# EAGLE design V8502_v1 (EAGLE 7.7.0)
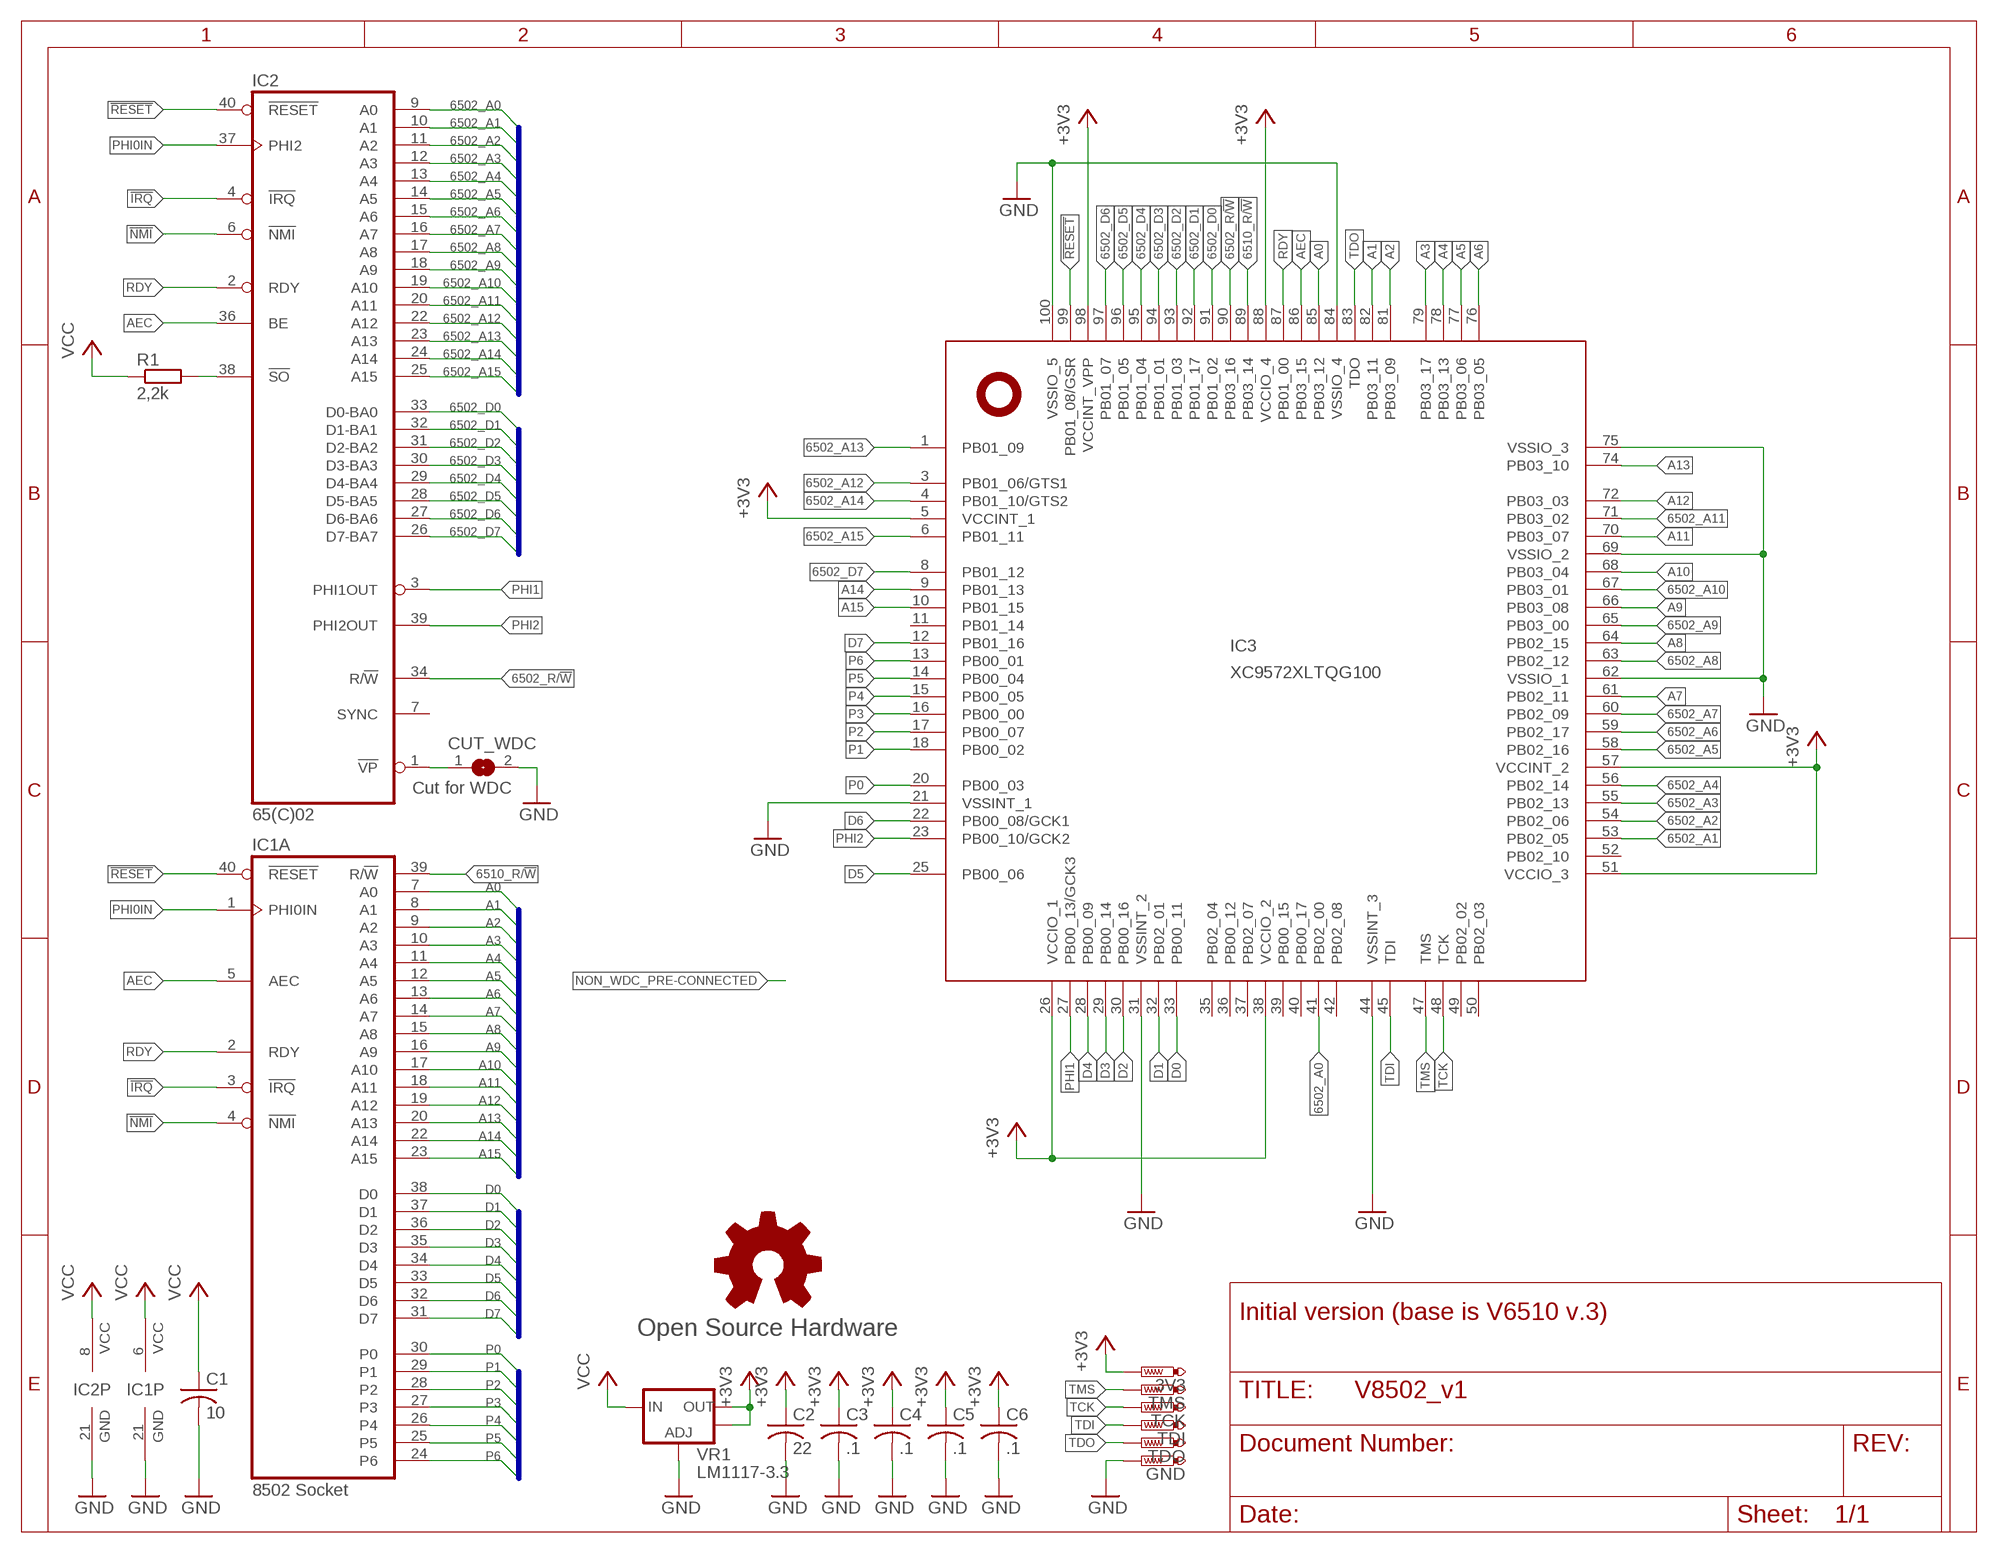
[diagram p0: schematic, sheet 1]

## Parts
3V3  PTR1TP08R  [TP08R]
C1  10  C-USC0805  [C0805]
C2  22  C-USC0805  [C0805]
C3  .1  C-USC0603  [C0603]
C4  .1  C-USC0603  [C0603]
C5  .1  C-USC0603  [C0603]
C6  .1  C-USC0603  [C0603]
CUT_WDC  Cut for WDC  SJ  [SJ]
GND  PTR1TP08R  [TP08R]
GOLD_ORB_SM1  Open Source Hardware  OSHWLOGOLOGO5MM  [OSHW_5MM]
IC1  8502 Socket  8502  [DIL40-ROUNDPAD]
IC2  65(C)02  W65C02S-RP  [DIL40-ROUNDPAD]
IC3  XC9572XLTQG100  [TQFP100]
R1  2,2k  RESISTOR_0603  [0603]
TCK  PTR1TP08R  [TP08R]
TDI  PTR1TP08R  [TP08R]
TDO  PTR1TP08R  [TP08R]
TMS  PTR1TP08R  [TP08R]
VR1  LM1117-3.3  V_REG_LM1117SOT223  [SOT223]

## Nets
6502_A0: IC2.9(A0) IC3.41(PB02_00)
6502_A1: IC2.10(A1) IC3.53(PB02_05)
6502_A2: IC2.11(A2) IC3.54(PB02_06)
6502_A3: IC2.12(A3) IC3.55(PB02_13)
6502_A4: IC2.13(A4) IC3.56(PB02_14)
6502_A5: IC2.14(A5) IC3.58(PB02_16)
6502_A6: IC2.15(A6) IC3.59(PB02_17)
6502_A7: IC2.16(A7) IC3.60(PB02_09)
6502_A8: IC2.17(A8) IC3.63(PB02_12)
6502_A9: IC2.18(A9) IC3.65(PB03_00)
6502_A10: IC2.19(A10) IC3.67(PB03_01)
6502_A11: IC2.20(A11) IC3.71(PB03_02)
6502_A12: IC2.22(A12) IC3.3(PB01_06/GTS1)
6502_A13: IC2.23(A13) IC3.1(PB01_09)
6502_A14: IC2.24(A14) IC3.4(PB01_10/GTS2)
6502_A15: IC2.25(A15) IC3.6(PB01_11)
6502_D0: IC2.33(D0-BA0) IC3.91(PB01_02)
6502_D1: IC2.32(D1-BA1) IC3.92(PB01_17)
6502_D2: IC2.31(D2-BA2) IC3.93(PB01_03)
6502_D3: IC2.30(D3-BA3) IC3.94(PB01_01)
6502_D4: IC2.29(D4-BA4) IC3.95(PB01_04)
6502_D5: IC2.28(D5-BA5) IC3.96(PB01_05)
6502_D6: IC2.27(D6-BA6) IC3.97(PB01_07)
6502_D7: IC2.26(D7-BA7) IC3.8(PB01_12)
6502_R/!W: IC2.34(R/!W) IC3.90(PB03_16)
6502_VSS: CUT_WDC.1 IC2.1(!VP)
6510_R/!W: IC1.39(A:R/!W) IC3.89(PB03_14)
!IRQ: IC1.3(A:!IRQ) IC2.4(!IRQ)
!NMI: IC1.4(A:!NMI) IC2.6(!NMI)
!RESET: IC1.40(A:!RESET) IC2.40(!RESET) IC3.99(PB01_08/GSR)
!SO: IC2.38(!SO) R1.2
+3V3: 3V3.TP C2.1 C3.1 C4.1 C5.1 C6.1 IC3.5(VCCINT_1) IC3.26(VCCIO_1) IC3.38(VCCIO_2) IC3.51(VCCIO_3) IC3.57(VCCINT_2) IC3.88(VCCIO_4) IC3.98(VCCINT_VPP) VR1.2(OUT) VR1.4(OUT)
A0: IC1.7(A:A0) IC3.85(PB03_12)
A1: IC1.8(A:A1) IC3.82(PB03_11)
A2: IC1.9(A:A2) IC3.81(PB03_09)
A3: IC1.10(A:A3) IC3.79(PB03_17)
A4: IC1.11(A:A4) IC3.78(PB03_13)
A5: IC1.12(A:A5) IC3.77(PB03_06)
A6: IC1.13(A:A6) IC3.76(PB03_05)
A7: IC1.14(A:A7) IC3.61(PB02_11)
A8: IC1.15(A:A8) IC3.64(PB02_15)
A9: IC1.16(A:A9) IC3.66(PB03_08)
A10: IC1.17(A:A10) IC3.68(PB03_04)
A11: IC1.18(A:A11) IC3.70(PB03_07)
A12: IC1.19(A:A12) IC3.72(PB03_03)
A13: IC1.20(A:A13) IC3.74(PB03_10)
A14: IC1.22(A:A14) IC3.9(PB01_13)
A15: IC1.23(A:A15) IC3.10(PB01_15)
AEC: IC1.5(A:AEC) IC2.36(BE) IC3.86(PB03_15)
D0: IC1.38(A:D0) IC3.33(PB00_11)
D1: IC1.37(A:D1) IC3.32(PB02_01)
D2: IC1.36(A:D2) IC3.30(PB00_16)
D3: IC1.35(A:D3) IC3.29(PB00_14)
D4: IC1.34(A:D4) IC3.28(PB00_09)
D5: IC1.33(A:D5) IC3.25(PB00_06)
D6: IC1.32(A:D6) IC3.22(PB00_08/GCK1)
D7: IC1.31(A:D7) IC3.12(PB01_16)
GND: C1.2 C2.2 C3.2 C4.2 C5.2 C6.2 CUT_WDC.2 GND.TP IC1.21(P:GND) IC2.21(GND) IC3.21(VSSINT_1) IC3.31(VSSINT_2) IC3.44(VSSINT_3) IC3.62(VSSIO_1) IC3.69(VSSIO_2) IC3.75(VSSIO_3) IC3.84(VSSIO_4) IC3.100(VSSIO_5) VR1.1(ADJ)
P0: IC1.30(A:P0) IC3.20(PB00_03)
P1: IC1.29(A:P1) IC3.18(PB00_02)
P2: IC1.28(A:P2) IC3.17(PB00_07)
P3: IC1.27(A:P3) IC3.16(PB00_00)
P4: IC1.26(A:P4) IC3.15(PB00_05)
P5: IC1.25(A:P5) IC3.14(PB00_04)
P6: IC1.24(A:P6) IC3.13(PB00_01)
PHI0IN: IC1.1(A:PHI0IN) IC2.37(PHI2)
PHI1: IC2.3(PHI1OUT) IC3.27(PB00_13/GCK3)
PHI2: IC2.39(PHI2OUT) IC3.23(PB00_10/GCK2)
RDY: IC1.2(A:RDY) IC2.2(RDY) IC3.87(PB01_00)
TCK: IC3.48(TCK) TCK.TP
TDI: IC3.45(TDI) TDI.TP
TDO: IC3.83(TDO) TDO.TP
TMS: IC3.47(TMS) TMS.TP
VCC: C1.1 IC1.6(P:VCC) IC2.8(VCC) R1.1 VR1.3(IN)
Unconnected: IC2.7(SYNC) IC3.11(PB01_14) IC3.35(PB02_04) IC3.36(PB00_12) IC3.37(PB02_07) IC3.39(PB00_15) IC3.40(PB00_17) IC3.42(PB02_08) IC3.49(PB02_02) IC3.50(PB02_03) IC3.52(PB02_10)

## Buses
A[0..15]
6502_D[0..7]
P[0..6]
D[0..7]
6502_A[0..15]

## Notes on the sheet
- Initial version (base is V6510 v.3)

## Library data of the parts
3V3 GND TCK TDI TDO TMS = testpad:PTR1: TEST PIN
C1-C6 = rcl:C-US: CAPACITOR, American symbol
CUT_WDC = jumper-jlb:SJ: SMD solder JUMPER
GOLD_ORB_SM1 = oshw:OSHWLOGO: The OSHW logo for PCB layout
IC1 = commodore:8502
IC2 = commodore:W65C02S: WDC W65C02S
IC3 = xilinx_xc95XXXxl:XC9572XLTQG100
R1 = _smd:RESISTOR: Widerstand Minimelf / 1206 0,25W
VR1 = SparkFun:V_REG_LM1117: Voltage Regulator LM1117 Standard adjustable voltage regulator but in SMD form. Spark Fun Electronics SKU : COM-00595

## Board
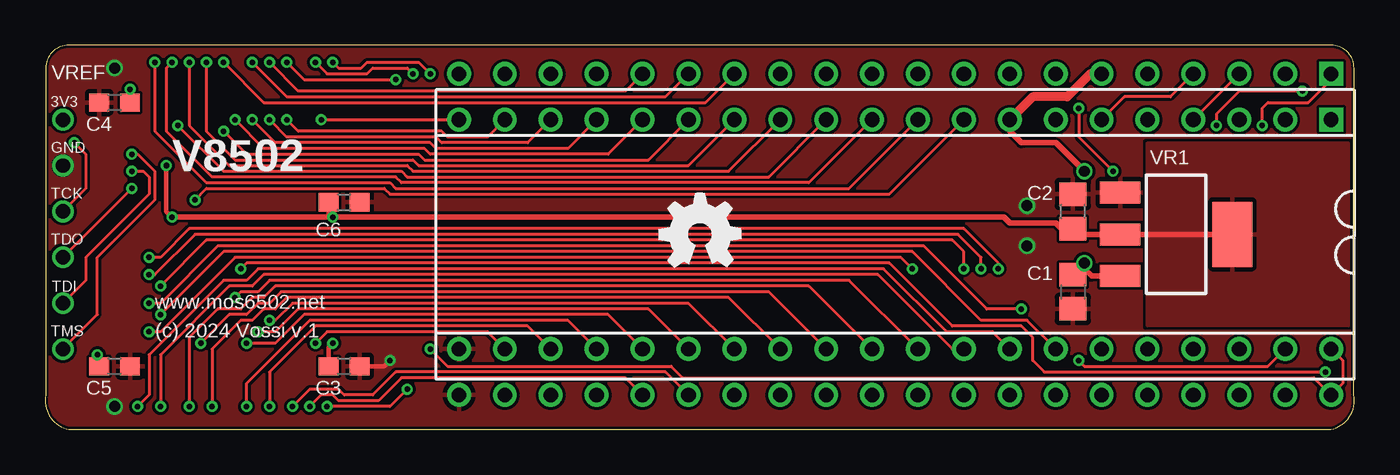
[diagram p1: board, top side]
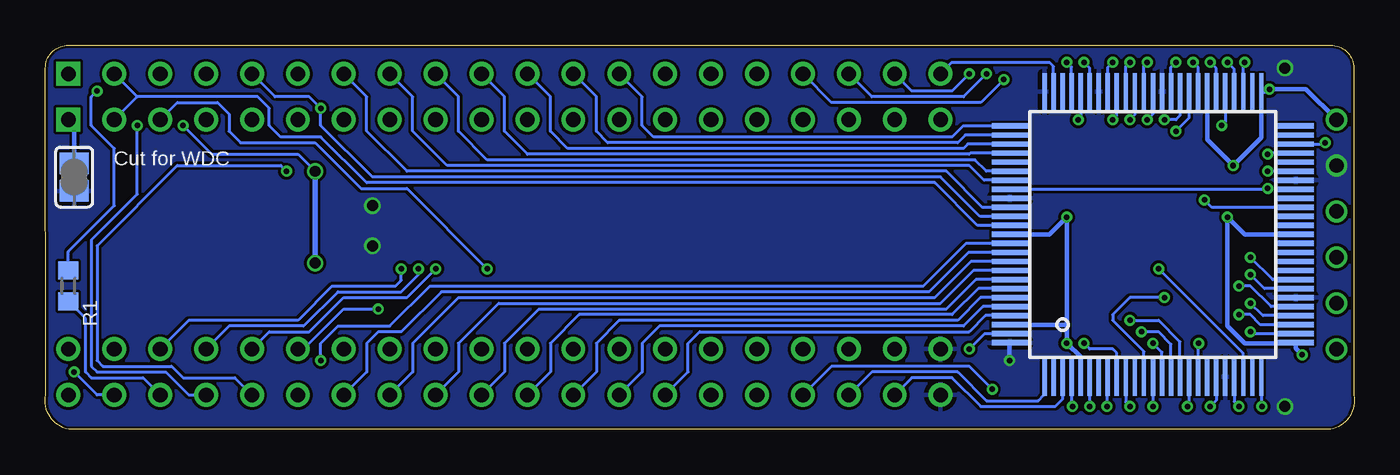
[diagram p2: board, bottom side, seen from below]

Size 72.43 x 21.27 mm. Coordinates in mm from the lower left corner, seen from the top.
Outline: 0.03,20 0.03,1.91 arc90 1.3,0 71.13,0 arc90 72.4,1.91 72.42,20 arc90 71.15,21.27 1.3,21.27 arc90 0.03,20
Copper layers (1*16): Top 0.035mm / dielectric 1.5mm / Bottom 0.035mm
Design rules "hackvana *": minimum track width 6mil, minimum drill 0.3mm, track to track 6mil, track to pad 6mil, pad to pad 6mil, via to via 6mil, smd to smd 0mil, copper to edge 6mil, drill to drill 6mil, minimum pad ring 10mil, minimum via ring 6mil, stop-mask expansion 2mil, vias tented up to drill 100mil, thermal gap 10mil

### Footprints (pad centres in the part's own frame; a part is rotated, then mirrored left to right if it is on the bottom)
TP08R = smd 0.8 x 0.8: TP 0,0
C0805 = smd 1.3 x 1.5: 1 -0.95,0; 2 0.95,0
C0603 = smd 1.1 x 1: 1 -0.85,0; 2 0.85,0
SJ = smd 1.168 x 1.6: 1 -0.762,0; 2 0.762,0
DIL40-ROUNDPAD = drill 0.813 square: 1 -24.13,-7.62 | drill 0.813: 2 -21.59,-7.62; 3 -19.05,-7.62; 4 -16.51,-7.62; 5 -13.97,-7.62; 6 -11.43,-7.62; 7 -8.89,-7.62; 8 -6.35,-7.62; 9 -3.81,-7.62; 10 -1.27,-7.62; 11 1.27,-7.62; 12 3.81,-7.62; 13 6.35,-7.62; 14 8.89,-7.62; 15 11.43,-7.62; 16 13.97,-7.62; 17 16.51,-7.62; 18 19.05,-7.62; 19 21.59,-7.62; 20 24.13,-7.62; 21 24.13,7.62; 22 21.59,7.62; 23 19.05,7.62; 24 16.51,7.62; 25 13.97,7.62; 26 11.43,7.62; 27 8.89,7.62; 28 6.35,7.62; 29 3.81,7.62; 30 1.27,7.62; 31 -1.27,7.62; 32 -3.81,7.62; 33 -6.35,7.62; 34 -8.89,7.62; 35 -11.43,7.62; 36 -13.97,7.62; 37 -16.51,7.62; 38 -19.05,7.62; 39 -21.59,7.62; 40 -24.13,7.62
TQFP100 = smd 0.254 x 2.032: 1 -6,-7.9; 2 -5.5,-7.9; 3 -5,-7.9; 4 -4.5,-7.9; 5 -4,-7.9; 6 -3.5,-7.9; 7 -3,-7.9; 8 -2.5,-7.9; 9 -2,-7.9; 10 -1.5,-7.9; 11 -1,-7.9; 12 -0.5,-7.9; 13 0,-7.9; 14 0.5,-7.9; 15 1,-7.9; 16 1.5,-7.9; 17 2,-7.9; 18 2.5,-7.9; 19 3,-7.9; 20 3.5,-7.9; 21 4,-7.9; 22 4.5,-7.9; 23 5,-7.9; 24 5.5,-7.9; 25 6,-7.9; 51 6,7.9; 52 5.5,7.9; 53 5,7.9; 54 4.5,7.9; 55 4,7.9; 56 3.5,7.9; 57 3,7.9; 58 2.5,7.9; 59 2,7.9; 60 1.5,7.9; 61 1,7.9; 62 0.5,7.9; 63 0,7.9; 64 -0.5,7.9; 65 -1,7.9; 66 -1.5,7.9; 67 -2,7.9; 68 -2.5,7.9; 69 -3,7.9; 70 -3.5,7.9; 71 -4,7.9; 72 -4.5,7.9; 73 -5,7.9; 74 -5.5,7.9; 75 -6,7.9 | smd 2.032 x 0.254: 26 7.9,-6; 27 7.9,-5.5; 28 7.9,-5; 29 7.9,-4.5; 30 7.9,-4; 31 7.9,-3.5; 32 7.9,-3; 33 7.9,-2.5; 34 7.9,-2; 35 7.9,-1.5; 36 7.9,-1; 37 7.9,-0.5; 38 7.9,0; 39 7.9,0.5; 40 7.9,1; 41 7.9,1.5; 42 7.9,2; 43 7.9,2.5; 44 7.9,3; 45 7.9,3.5; 46 7.9,4; 47 7.9,4.5; 48 7.9,5; 49 7.9,5.5; 50 7.9,6; 76 -7.9,6; 77 -7.9,5.5; 78 -7.9,5; 79 -7.9,4.5; 80 -7.9,4; 81 -7.9,3.5; 82 -7.9,3; 83 -7.9,2.5; 84 -7.9,2; 85 -7.9,1.5; 86 -7.9,1; 87 -7.9,0.5; 88 -7.9,0; 89 -7.9,-0.5; 90 -7.9,-1; 91 -7.9,-1.5; 92 -7.9,-2; 93 -7.9,-2.5; 94 -7.9,-3; 95 -7.9,-3.5; 96 -7.9,-4; 97 -7.9,-4.5; 98 -7.9,-5; 99 -7.9,-5.5; 100 -7.9,-6
0603 = smd 1 x 1.1: 1 -0.85,0; 2 0.85,0
SOT223 = smd 1.219 x 2.235: 1 -2.311,-3.099; 2 0,-3.099; 3 2.311,-3.099 | smd 3.6 x 2.2: 4 0,3.099

### Placement (x,y rotation side)
3V3  0.98,17.14 0 top
C1  56.86,7.62 270 top
C2  56.86,12.06 90 top
C3  16.54,3.49 0 top
C4  3.84,18.1 180 top
C5  3.84,3.49 0 top
C6  16.54,12.57 0 top
CUT_WDC  70.83,13.97 270 bottom
GND  0.98,14.61 0 top
GOLD_ORB_SM1  36.23,10.79 0 top
IC1  47.02,12.06 180 top
IC2  47.02,9.53 180 top
IC3  11.14,10.79 0 bottom
R1  71.15,7.94 270 bottom
TCK  0.98,12.06 0 top
TDI  0.98,6.99 0 top
TDO  0.98,9.53 0 top
TMS  0.98,4.45 0 top
VR1  62.58,10.79 270 top

### Tracks (layer width: path | path; a pad name or v marks a point on that pad's centre or on a via)
6502_A0  (via drill 0.3)
  Top 0.152: IC2.9 46.7,13.02 19.08,13.02 18.76,13.34 8.92,13.34 v8.29,12.7
  Bottom 0.152: IC3.41 7.88,12.29 v8.29,12.7
6502_A1  (via drill 0.3)
  Top 0.152: IC2.10 44.48,13.34 19.4,13.34 19.08,13.65 8.92,13.65 6.06,16.51 v6.06,20.32
  Bottom 0.152: IC3.53 6.14,20.08 6.06,20.16 v6.06,20.32
6502_A2  (via drill 0.3)
  Top 0.152: IC2.11 42.26,13.65 19.72,13.65 19.4,13.97 9.24,13.97 6.7,16.51 6.7,20 v7.02,20.32
  Bottom 0.152: IC3.54 6.64,19.95 v7.02,20.32
6502_A3  (via drill 0.3)
  Top 0.152: IC2.12 40.04,13.97 20.03,13.97 19.72,14.29 9.87,14.29 v7.33,16.83
  Bottom 0.152: IC3.55 7.14,17.02 v7.33,16.83
6502_A4  (via drill 0.3)
  Top 0.152: IC2.13 37.81,14.29 20.35,14.29 20.03,14.61 10.19,14.61 7.97,16.83 v7.97,20.32
  Bottom 0.152: IC3.56 7.64,20 v7.97,20.32
6502_A5  (via drill 0.3)
  Top 0.152: IC2.14 35.59,14.61 20.67,14.61 20.35,14.92 10.51,14.92 8.92,16.51 v8.92,20.32
  Bottom 0.152: IC3.58 8.64,20.04 v8.92,20.32
6502_A6  (via drill 0.3)
  Top 0.152: IC2.15 33.37,14.92 20.99,14.92 20.67,15.24 11.14,15.24 v9.87,16.51
  Bottom 0.152: IC3.59 9.14,17.24 v9.87,16.51
6502_A7  (via drill 0.3)
  Top 0.152: IC2.16 31.15,15.24 21.3,15.24 20.99,15.56 12.1,15.56 v10.51,17.14
  Bottom 0.152: IC3.60 9.64,17.38 9.87,17.14 v10.51,17.14
6502_A8  (via drill 0.3)
  Top 0.152: IC2.17 28.92,15.56 21.62,15.56 21.3,15.88 12.73,15.88 v11.46,17.14
  Bottom 0.152: v11.46,17.14 11.14,17.46 IC3.63
6502_A9  (via drill 0.3)
  Top 0.152: IC2.18 26.7,15.88 21.94,15.88 21.62,16.19 13.37,16.19 v12.41,17.14
  Bottom 0.152: IC3.65 12.14,17.41 v12.41,17.14
6502_A10  (via drill 0.3)
  Top 0.152: IC2.19 24.48,16.19 22.26,16.19 21.94,16.51 14,16.51 v13.37,17.14
  Bottom 0.152: v13.37,17.14 13.14,17.37 IC3.67
6502_A11  (via drill 0.3)
  Top 0.152: v15.27,17.14 IC2.20
  Bottom 0.152: IC3.71 15.14,17.27 v15.27,17.14
6502_A12
  Bottom 0.152: IC2.22 24.48,2.86 22.26,2.86 20.67,1.27 16.54,1.27 16.14,1.67 IC3.3
6502_A13
  Bottom 0.152: IC2.23 26.7,3.17 21.94,3.17 20.35,1.59 17.49,1.59 17.18,1.91 17.18,2.86 IC3.1
6502_A14  (via drill 0.3)
  Top 0.152: v20.03,2.22 19.08,1.27 v15.59,1.27
  Bottom 0.152: IC2.24 28.92,3.49 21.3,3.49 v20.03,2.22 | IC3.4 15.64,1.32 v15.59,1.27
6502_A15  (via drill 0.3)
  Top 0.152: IC2.25 32.1,2.86 19.72,2.86 18.45,1.59 16.22,1.59 15.91,1.91 15.27,1.91 v14.64,1.27
  Bottom 0.152: v14.64,1.27 IC3.6
6502_D0
  Bottom 0.152: IC2.33 52.1,3.17 52.1,4.76 49.56,7.3 23.21,7.3 21.22,9.29 IC3.91
6502_D1
  Bottom 0.152: IC2.32 49.56,3.17 49.56,4.76 47.34,6.99 22.89,6.99 21.08,8.79 IC3.92
6502_D2
  Bottom 0.152: IC2.31 47.02,3.17 47.02,4.76 45.12,6.67 22.57,6.67 20.95,8.29 IC3.93
6502_D3
  Bottom 0.152: IC2.30 44.48,3.17 44.48,4.76 42.89,6.35 22.26,6.35 20.81,7.79 IC3.94
6502_D4
  Bottom 0.152: IC2.29 41.94,3.17 41.94,4.76 40.67,6.03 21.94,6.03 20.68,7.29 IC3.95
6502_D5
  Bottom 0.152: IC2.28 39.4,3.17 39.4,4.76 38.45,5.71 21.62,5.71 20.54,6.79 IC3.96
6502_D6
  Bottom 0.152: IC2.27 36.86,3.17 36.86,4.76 36.23,5.4 21.3,5.4 20.41,6.29 IC3.97
6502_D7  (via drill 0.3)
  Top 0.152: IC2.26 34.32,3.17 19.4,3.17 18.13,1.91 16.54,1.91 16.22,2.22 14.64,2.22 v13.68,1.27
  Bottom 0.152: IC3.8 13.68,2.85 v13.68,1.27
6502_R/!W
  Bottom 0.152: IC3.90 21.35,9.79 23.53,7.62 50.51,7.62 52.74,5.4 54.01,5.4 54.64,4.76 54.64,3.17 IC2.34
6502_VSS
  Bottom 0.254: IC2.1 70.83,16.83 CUT_WDC.1
6510_R/!W  (via drill 0.3)
  Top 0.152: IC1.39 67.66,3.49 57.5,3.49 v57.18,3.81
  Bottom 0.152: IC3.89 21.49,10.29 23.84,7.94 51.15,7.94 53.37,5.71 56.23,5.71 57.18,4.76 v57.18,3.81
!IRQ
  Top 0.152: IC1.3 IC2.4
!NMI
  Top 0.152: IC2.6 59.72,18.41 62.26,18.41 IC1.4
!RESET  (via drill 0.3)
  Top 0.152: v21.3,4.45 22.26,3.49 34.64,3.49 35.27,2.86 70.2,2.86 IC2.40 71.79,2.54 71.79,3.81 IC1.40
  Bottom 0.152: IC3.99 20.45,5.29 v21.3,4.45
!SO
  Bottom 0.152: IC2.38 67.02,2.86 69.88,2.86 70.2,3.17 70.2,6.13 R1.2
+3V3  (via drill 0.3, 0.8)
  Top 0.254: C4.1 v4.69,18.84 | v7.02,11.75 6.7,12.06 v6.7,14.61 | v2.89,4.13 2.89,3.6 C5.1 | C3.1 15.69,4.55 v15.91,4.76 | C6.1 15.69,11.96 v15.91,11.75
  Top 0.305: 3V3.TP 0.98,16.83 | VR1.4 VR1.2 57.18,10.79 C2.1 56.23,11.12 55.92,11.43 53.37,11.43 53.05,11.75 v15.91,11.75 v7.02,11.75
  Bottom 0.254: IC3.26 4.13,4.79 | IC3.38 6.06,10.79 v7.02,11.75 7.02,5.71 6.06,4.76 3.28,4.76 IC3.26 | IC3.26 3.24,4.48 v2.89,4.13 | IC3.88 16.86,10.79 v15.91,11.75 15.91,5.71 | IC3.98 15.99,5.79 15.91,5.71 | 15.91,5.71 v15.91,4.76 15.14,4 IC3.5 | IC3.57 8.14,16.05 v6.7,14.61 5.14,16.16 IC3.51 4.83,18.7 v4.69,18.84 2.67,18.84 3V3.TP
  other vias: 0.98,17.14
  pour Top: 60.99,15.88 72.1,15.88 72.1,5.71 60.99,5.71
A0
  Bottom 0.152: IC3.85 20.58,12.29 22.57,14.29 52.42,14.29 54.64,16.51 54.64,18.41 IC1.7
A1
  Bottom 0.152: IC3.82 20.49,13.79 21.3,14.61 50.2,14.61 52.1,16.51 52.1,18.41 IC1.8
A2
  Bottom 0.152: IC3.81 20.36,14.29 20.99,14.92 47.97,14.92 49.56,16.51 49.56,18.41 IC1.9
A3
  Bottom 0.152: IC3.79 21.25,15.29 21.3,15.24 45.75,15.24 47.02,16.51 47.02,18.41 IC1.10
A4
  Bottom 0.152: IC3.78 21.38,15.79 21.62,15.56 43.53,15.56 44.48,16.51 44.48,18.41 IC1.11
A5
  Bottom 0.152: IC3.77 21.52,16.3 21.94,15.88 41.31,15.88 41.94,16.51 41.94,18.41 IC1.12
A6
  Bottom 0.152: IC3.76 21.65,16.8 22.26,16.19 38.77,16.19 39.4,16.83 39.4,18.41 IC1.13
A7  (via drill 0.3)
  Top 0.152: v9.87,20.32 12.1,18.1 36.54,18.1 IC1.14
  Bottom 0.152: IC3.61 10.14,20.05 v9.87,20.32
A8  (via drill 0.3)
  Top 0.152: v11.46,20.32 13.37,18.41 34.32,18.41 IC1.15
  Bottom 0.152: IC3.64 11.64,20.14 v11.46,20.32
A9  (via drill 0.3)
  Top 0.152: v12.41,20.32 14,18.73 32.1,18.73 IC1.16
  Bottom 0.152: IC3.66 12.64,20.09 v12.41,20.32
A10  (via drill 0.3)
  Top 0.152: v13.37,20.32 14.32,19.37 v19.4,19.37
  Bottom 0.152: v19.4,19.37 20.67,18.1 28.92,18.1 IC1.17 | IC3.68 13.64,20.04 v13.37,20.32
A11  (via drill 0.3)
  Top 0.152: v14.95,20.32 15.59,19.68 17.81,19.68 18.13,20 20.03,20 v20.35,19.68
  Bottom 0.152: IC3.70 14.64,20.01 v14.95,20.32 | v20.35,19.68 21.62,18.41 26.7,18.41 IC1.18
A12  (via drill 0.3)
  Top 0.152: v15.91,20.32 16.22,20 17.49,20 17.81,20.32 20.67,20.32 v21.3,19.68
  Bottom 0.152: IC3.72 15.64,20.06 v15.91,20.32 | v21.3,19.68 22.26,18.73 24.48,18.73 IC1.19
A13
  Bottom 0.152: IC3.74 16.64,20.11 16.86,20.32 22.26,20.32 IC1.20
A14  (via drill 0.3)
  Top 0.152: v14.95,4.76 15.59,5.4 24.48,5.4 IC1.22
  Bottom 0.152: IC3.9 13.14,4.22 13.37,4.45 14.64,4.45 v14.95,4.76
A15  (via drill 0.3)
  Top 0.152: v12.41,1.27 12.41,3.17 14.95,5.71 26.7,5.71 IC1.23
  Bottom 0.152: IC3.10 12.64,1.5 v12.41,1.27
AEC  (via drill 0.3)
  Top 0.152: v57.18,17.78 57.18,16.19 v59.09,14.29
  Bottom 0.152: IC2.36 61.94,2.86 64.8,2.86 65.44,3.49 69.25,3.49 69.56,3.81 69.56,10.16 65.12,14.61 59.4,14.61 v59.09,14.29 | IC3.86 20.72,11.79 22.89,13.97 54.32,13.97 57.18,16.83 v57.18,17.78 57.82,18.41 59.72,18.41 IC1.5
D0  (via drill 0.3)
  Top 0.152: v52.74,8.89 52.74,9.21 50.83,11.11 7.97,11.11 6.38,9.53 v5.75,9.53
  Bottom 0.152: v52.74,8.89 52.74,8.26 53.05,7.94 56.55,7.94 58.45,6.03 64.48,6.03 IC1.38 | IC3.33 4.52,8.29 v5.75,9.53
D1  (via drill 0.3)
  Top 0.152: v51.78,8.89 51.78,9.53 50.51,10.79 8.29,10.79 6.06,8.57 v5.75,8.57
  Bottom 0.152: v51.78,8.89 51.78,8.57 52.74,7.62 56.23,7.62 58.13,5.71 62.26,5.71 IC1.37 | IC3.32 4.97,7.79 v5.75,8.57
D2  (via drill 0.3)
  Top 0.152: v50.83,8.89 50.83,9.84 50.2,10.48 8.92,10.48 v6.38,7.94
  Bottom 0.152: v50.83,8.89 52.42,7.3 55.91,7.3 57.82,5.4 60.04,5.4 IC1.36 | IC3.30 4.6,6.79 5.75,7.94 v6.38,7.94
D3  (via drill 0.3)
  Top 0.152: v54.01,6.67 52.1,6.67 48.61,10.16 9.56,10.16 6.38,6.99 v5.75,6.99
  Bottom 0.152: IC3.29 5.06,6.29 v5.75,6.99 | IC1.35 58.13,4.45 55.91,6.67 v54.01,6.67
D4  (via drill 0.3)
  Top 0.152: v6.38,6.35 9.87,9.84 47.97,9.84 51.78,6.03 54.32,6.03 IC1.34
  Bottom 0.152: IC3.28 5.19,5.79 5.75,6.35 v6.38,6.35
D5  (via drill 0.3)
  Top 0.152: v5.11,1.27 5.75,1.91 5.75,4.13 9.87,8.26 11.14,8.26 11.78,8.89 46.39,8.89 49.88,5.4 52.42,5.4 IC1.33
  Bottom 0.152: IC3.25 5.14,1.3 v5.11,1.27
D6  (via drill 0.3)
  Top 0.152: v6.38,1.27 6.38,4.13 10.19,7.94 11.46,7.94 12.1,8.57 46.07,8.57 50.2,4.45 IC1.32
  Bottom 0.152: IC3.22 6.64,1.53 v6.38,1.27
D7  (via drill 0.3)
  Top 0.152: v10.51,7.3 10.83,7.62 11.78,7.62 12.41,8.26 44.48,8.26 IC1.31
  Bottom 0.152: v10.51,7.3 12.41,7.3 13.37,6.35 13.37,6.03 11.64,4.31 IC3.12
GND  (via drill 0.3, 0.6, 0.61, 0.8)
  Top 0.254: C3.2 18.76,3.49 v19.08,3.81
  Bottom 0.254: 19.08,4.76 IC3.100 arc-90 19.08,4.76 | v19.08,3.81 19.08,4.76
  other vias: 0.98,14.61 54.32,12.38 54.32,10.16 3.84,20 3.84,1.27
  pour Top (rank 2): 1.3,21.27 71.47,21.27 arc-90 72.42,19.68 72.42,1.91 arc-90 71.15,0 1.3,0 arc-90 0.03,1.91 0.03,19.68 arc-90
  pour Bottom (rank 2): 1.3,21.27 71.15,21.27 arc-90 72.42,20 72.42,1.91 arc-90 71.15,0 1.3,0 arc-90 0.03,1.91 0.03,19.68 arc-90
NON_WDC_PRE-CONNECTED
  Bottom 0.152: 70.83,14.29 70.83,13.65
P0  (via drill 0.3)
  Top 0.152: v7.97,1.27 7.97,5.08 9.56,6.67 10.83,6.67 11.46,7.3 12.1,7.3 12.73,7.94 42.26,7.94 IC1.30
  Bottom 0.152: IC3.20 7.64,1.59 v7.97,1.27
P1  (via drill 0.3)
  Top 0.152: v8.6,4.76 10.19,6.35 11.14,6.35 11.78,6.99 12.41,6.99 13.05,7.62 40.04,7.62 IC1.29
  Bottom 0.152: IC3.18 8.64,4.72 v8.6,4.76
P2  (via drill 0.3)
  Top 0.152: v9.24,1.27 9.24,4.45 10.83,6.03 11.46,6.03 12.1,6.67 12.73,6.67 13.37,7.3 37.81,7.3 IC1.28
  Bottom 0.152: IC3.17 9.14,1.36 v9.24,1.27
P3  (via drill 0.3)
  Top 0.152: v12.41,6.03 12.73,6.03 13.68,6.99 35.59,6.99 IC1.27
  Bottom 0.152: v12.41,6.03 10.83,6.03 9.64,4.85 IC3.16
P4  (via drill 0.3)
  Top 0.152: IC1.26 33.37,6.67 14,6.67 12.73,5.4 v11.78,5.4
  Bottom 0.152: v11.78,5.4 10.83,5.4 10.14,4.71 IC3.15
P5  (via drill 0.3)
  Top 0.152: v11.14,4.76 12.73,4.76 14.32,6.35 31.15,6.35 IC1.25
  Bottom 0.152: IC3.14 10.64,4.26 v11.14,4.76
P6  (via drill 0.3)
  Top 0.152: IC1.24 28.92,6.03 14.64,6.03 11.14,2.54 v11.14,1.27
  Bottom 0.152: IC3.13 v11.14,1.27
PHI0IN  (via drill 0.3)
  Top 0.152: v67.34,16.83 67.34,17.78 67.66,18.1 69.88,18.1 71.15,19.37 IC1.1
  Bottom 0.152: IC2.37 64.48,1.91 65.75,3.17 69.56,3.17 69.88,3.49 69.88,10.48 67.34,13.02 v67.34,16.83
PHI1  (via drill 0.3)
  Top 0.152: v47.97,8.89 47.34,9.53 10.51,9.53 6.38,5.4 v5.75,5.4
  Bottom 0.152: IC2.3 65.12,18.1 62.9,18.1 62.26,17.46 62.26,16.51 61.63,15.88 57.5,15.88 54.96,13.34 52.42,13.34 v47.97,8.89 | IC3.27 5.64,5.29 v5.75,5.4
PHI2  (via drill 0.3)
  Top 0.152: v10.83,8.89 11.14,9.21 46.7,9.21 50.2,5.71 54.01,5.71 54.64,5.08 54.64,3.81 55.28,3.17 v70.83,3.17
  Bottom 0.152: IC2.39 69.56,1.91 v70.83,3.17 | IC3.23 6.14,4.21 v10.83,8.89
RDY
  Bottom 0.152: IC3.87 20.85,11.29 23.21,13.65 54.64,13.65 57.18,16.19 59.4,16.19 60.04,16.83 60.04,17.78 60.67,18.41 67.34,18.41 | 67.34,18.41 IC2.2 | IC1.2 67.34,18.41
TCK  (via drill 0.3, 0.8)
  Top 0.152: v1.62,15.88 2.25,15.24 2.25,13.34 TCK.TP
  Bottom 0.152: IC3.48 1.7,15.79 arc-90 v1.62,15.88
  other vias: 0.98,12.06
TDI  (via drill 0.3, 0.8)
  Top 0.152: v4.79,14.29 5.43,14.29 5.75,13.97 5.75,13.02 2.25,9.53 2.25,8.26 TDI.TP
  Bottom 0.152: IC3.45 v4.79,14.29
  other vias: 0.98,6.99
TDO  (via drill 0.3, 0.8)
  Top 0.152: TDO.TP v4.79,13.34
  Bottom 0.152: IC3.83 4.83,13.29 v4.79,13.34
  other vias: 0.98,9.53
TMS  (via drill 0.3, 0.8)
  Top 0.152: TMS.TP 2.89,6.35 2.89,9.53 6.06,12.7 6.06,14.29 5.11,15.24 v4.79,15.24
  Bottom 0.152: IC3.47 4.74,15.29 v4.79,15.24
  other vias: 0.98,4.45
VCC  (via drill 0.3, 0.6)
  Top 0.152: v69.56,18.73 66.07,18.73 64.8,17.46 v64.8,16.83
  Top 0.305: v57.5,14.29 55.91,15.88 54.01,15.88 53.37,16.51 IC2.8 | VR1.3 57.91,8.48 57.5,8.89 | C1.1 57.18,8.57 57.5,8.89 | 57.5,8.89 v57.5,9.21
  Top 0.508: IC2.8 54.64,18.41 56.55,18.41 57.82,19.68 IC1.6
  Bottom 0.152: R1.1 71.15,9.84 68.61,12.38 68.61,15.56 69.88,16.83 69.88,18.41 v69.56,18.73 | v64.8,16.83 63.21,15.24 58.45,15.24 v57.5,14.29
  Bottom 0.305: v57.5,9.21 v57.5,14.29

### Text on the board
tNames: VREF | V8502 | www.mos6502.net | (c) 2024 Vossi v.1
bNames: Cut for WDC